# Altium schematic sheet Oscar_MainBoard_LCD.SchDoc
size A4
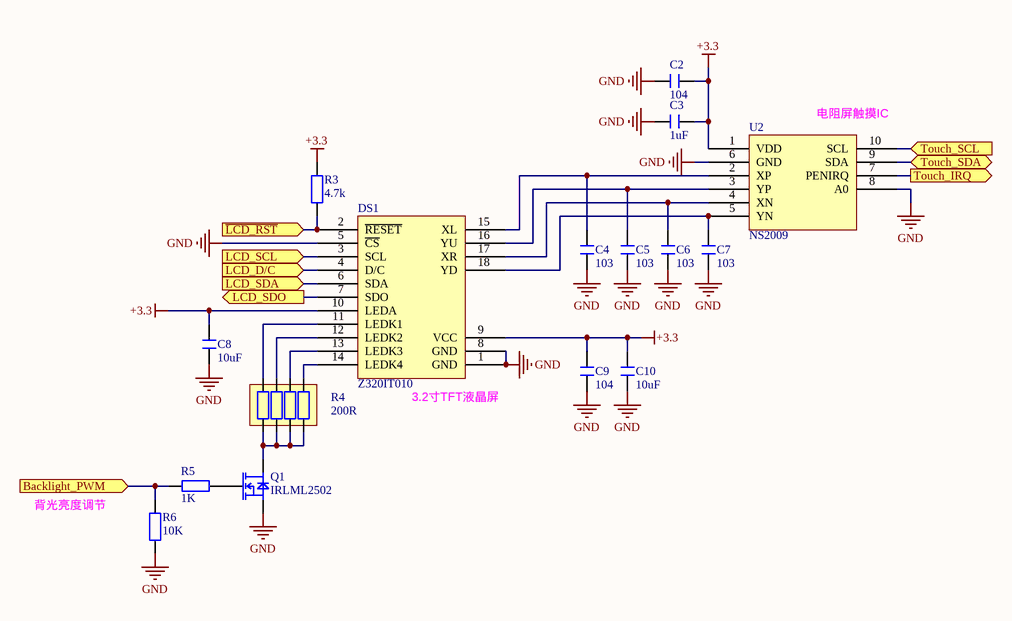
[diagram p0: Oscar_MainBoard_LCD.SchDoc]

## Parts
C2  104  [C 0402_L]
C3  1uF  [C 0402_L]
C4  103  [C 0402_L]
C5  103  [C 0402_L]
C6  103  [C 0402_L]
C7  103  [C 0402_L]
C8  10uF  [C 0603_L]
C9  104  [C 0402_L]
C10  10uF  [C 0603_L]
DS1  Z320IT010  [Z320IT010]
Q1  IRLML2502  [SOT23-3n]
R3  4.7k  [R 0402_L]
R4  200R  [RCA-8P4R-0402]
R5  1K  [R 0402_L]
R6  10K  [R 0402_L]
U2  NS2009  [MSOP10_N]

## Ports
Backlight_PWM (in), LCD_D/C (in), LCD_SCL (in), LCD_SDA (in), LCD_SDO (out), Touch_IRQ (out), Touch_SCL (in), Touch_SDA (bidir), ~{LCD_RST} (in)

## Nets
+3.3: C2.1 C3.1 C8.1 C9.1 C10.1 DS1.9(VCC) DS1.10(LEDA) R3.2 U2.1(VDD)
GND: C2.2 C3.2 C4.2 C5.2 C6.2 C7.2 C8.2 C9.2 C10.2 DS1.1(GND) DS1.5(~{CS}) DS1.8(GND) Q1.2(S) R6.1 U2.6(GND) U2.8(A0)
Backlight_PWM: R5.1 R6.2 ; port Backlight_PWM
~{LCD_RST}: DS1.2(~{RESET}) R3.1 ; port ~{LCD_RST}
LCD_D/C: DS1.4(D/C) ; port LCD_D/C
LCD_SCL: DS1.3(SCL) ; port LCD_SCL
LCD_SDA: DS1.6(SDA) ; port LCD_SDA
LCD_SDO: DS1.7(SDO) ; port LCD_SDO
Touch_IRQ: U2.7(PENIRQ) ; port Touch_IRQ
Touch_SCL: U2.10(SCL) ; port Touch_SCL
Touch_SDA: U2.9(SDA) ; port Touch_SDA
NetC4_1: C4.1 DS1.15(XL) U2.2(XP)
NetC5_1: C5.1 DS1.16(YU) U2.3(YP)
NetC6_1: C6.1 DS1.17(XR) U2.4(XN)
NetC7_1: C7.1 DS1.18(YD) U2.5(YN)
NetDS1_11: DS1.11(LEDK1) R4.8
NetDS1_12: DS1.12(LEDK2) R4.7
NetDS1_13: DS1.13(LEDK3) R4.6
NetDS1_14: DS1.14(LEDK4) R4.5
NetQ1_1: Q1.1(G) R5.2
NetQ1_3: Q1.3(D) R4.1 R4.2 R4.3 R4.4

## Notes on the sheet
- (near U2) 电阻屏触摸IC
- (near DS1) 3.2寸TFT液晶屏
- 背光亮度调节

## Library data of the parts
C2-C10 = C: 贴片电容; BOM名称: 无极性贴片电容; 优秀评价可免费更新: 联系淘宝ID：黄晶宝石，获取更新版封装库; 卖家免费技术支持，联系售后: 唯一出售店铺网址https://shop463601444.taobao.com; 本封装库来自淘宝卖家 ID：黄晶宝石: 其他店铺购入均为盗版，请立即申请退款
DS1 = Z320IT010: 3.2 inch TFT_LCD SPI
Q1 = IRLML2502: MOSFET N沟道 20V/4.2A
R3 R5 R6 = R: 贴片电阻; 优秀评价可免费更新: 联系淘宝ID：黄晶宝石，获取更新版封装库; 卖家免费技术支持，联系售后: 唯一出售店铺网址https://shop463601444.taobao.com; 本封装库来自淘宝卖家 ID：黄晶宝石: 其他店铺购入均为盗版，请立即申请退款; BOM名称: 贴片电阻
R4 = R-8P4R: 贴片排阻; BOM名称: 贴片网络排阻; 优秀评价可免费更新: 联系淘宝ID：黄晶宝石，获取更新版封装库; 卖家免费技术支持，联系售后: 唯一出售店铺网址https://shop463601444.taobao.com; 本封装库来自淘宝卖家 ID：黄晶宝石: 其他店铺购入均为盗版，请立即申请退款
U2 = NS2009: I2C接口的4线制电阻式触摸屏控制电路